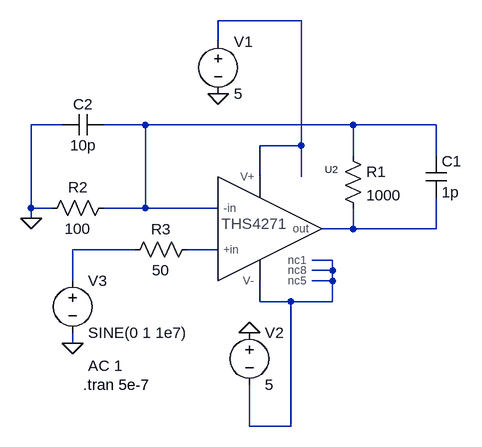
[diagram p0: schematic THS4271_Test.asc]
THS4271_Test.asc, the LTspice schematic file:
Version 4
SHEET 1 880 680
WIRE 32 -160 -96 -160
WIRE -96 -128 -96 -160
WIRE -336 0 -384 0
WIRE -208 0 -272 0
WIRE 112 0 -208 0
WIRE 240 0 112 0
WIRE 32 32 32 -160
WIRE 32 32 -32 32
WIRE 112 48 112 0
WIRE 240 48 240 0
WIRE -32 80 -32 32
WIRE 32 80 32 32
WIRE -384 128 -384 0
WIRE -352 128 -384 128
WIRE -208 128 -208 0
WIRE -208 128 -272 128
WIRE -96 128 -208 128
WIRE -384 144 -384 128
WIRE 112 160 112 128
WIRE 112 160 64 160
WIRE 240 160 240 112
WIRE 240 160 112 160
WIRE -224 192 -320 192
WIRE -96 192 -144 192
WIRE 80 208 48 208
WIRE 80 224 80 208
WIRE 80 224 48 224
WIRE -320 240 -320 192
WIRE 80 240 80 224
WIRE 80 240 48 240
WIRE -32 272 -32 240
WIRE 16 272 -32 272
WIRE 80 272 80 240
WIRE 80 272 16 272
WIRE -320 336 -320 320
WIRE -48 464 -48 400
WIRE 16 464 16 272
WIRE 16 464 -48 464
FLAG -48 320 0
FLAG -96 -48 0
FLAG -320 336 0
FLAG -384 144 0
SYMBOL voltage -96 -144 R0
SYMATTR InstName V1
SYMATTR Value 5
SYMBOL voltage -48 304 R0
SYMATTR InstName V2
SYMATTR Value 5
SYMBOL res 96 32 R0
SYMATTR InstName R1
SYMATTR Value 1000
SYMBOL res -256 112 R90
WINDOW 0 0 56 VBottom 0
WINDOW 3 32 56 VTop 0
SYMATTR InstName R2
SYMATTR Value 100
SYMBOL voltage -320 224 R0
WINDOW 123 24 147 Left 0
WINDOW 39 24 132 Left 0
SYMATTR Value2 AC 1
SYMATTR InstName V3
SYMATTR Value SINE(0 1 1e7)
SYMBOL cap 224 48 R0
SYMATTR InstName C1
SYMATTR Value 1p
SYMBOL cap -272 -16 R90
WINDOW 0 0 32 VBottom 0
WINDOW 3 32 32 VTop 0
SYMATTR InstName C2
SYMATTR Value 10p
SYMBOL res -128 176 R90
WINDOW 0 0 56 VBottom 0
WINDOW 3 32 56 VTop 0
SYMATTR InstName R3
SYMATTR Value 50
SYMBOL Opamps\\THS4271 -96 240 R0
SYMATTR InstName U2
TEXT -304 400 Left 0 !.tran 5e-7

The netlist it stands for:
* THS4271_Test.asc
V1 N001 0 5
V2 0 N006 5
R1 N002 N003 1000
R2 N002 0 100
V3 N004 0 SINE(0 1 1e7) AC 1
C1 N002 N003 1p
C2 N002 0 10p
R3 N005 N004 50
XU2 N006 N002 N005 N006 N006 N003 N001 N006 THS4271  ; pins nc1 -in +in V- nc5 out V+ nc8
.tran 5e-7
.lib THS4271.sub
.backanno
.end